# EAGLE design main (EAGLE 9.6.2)
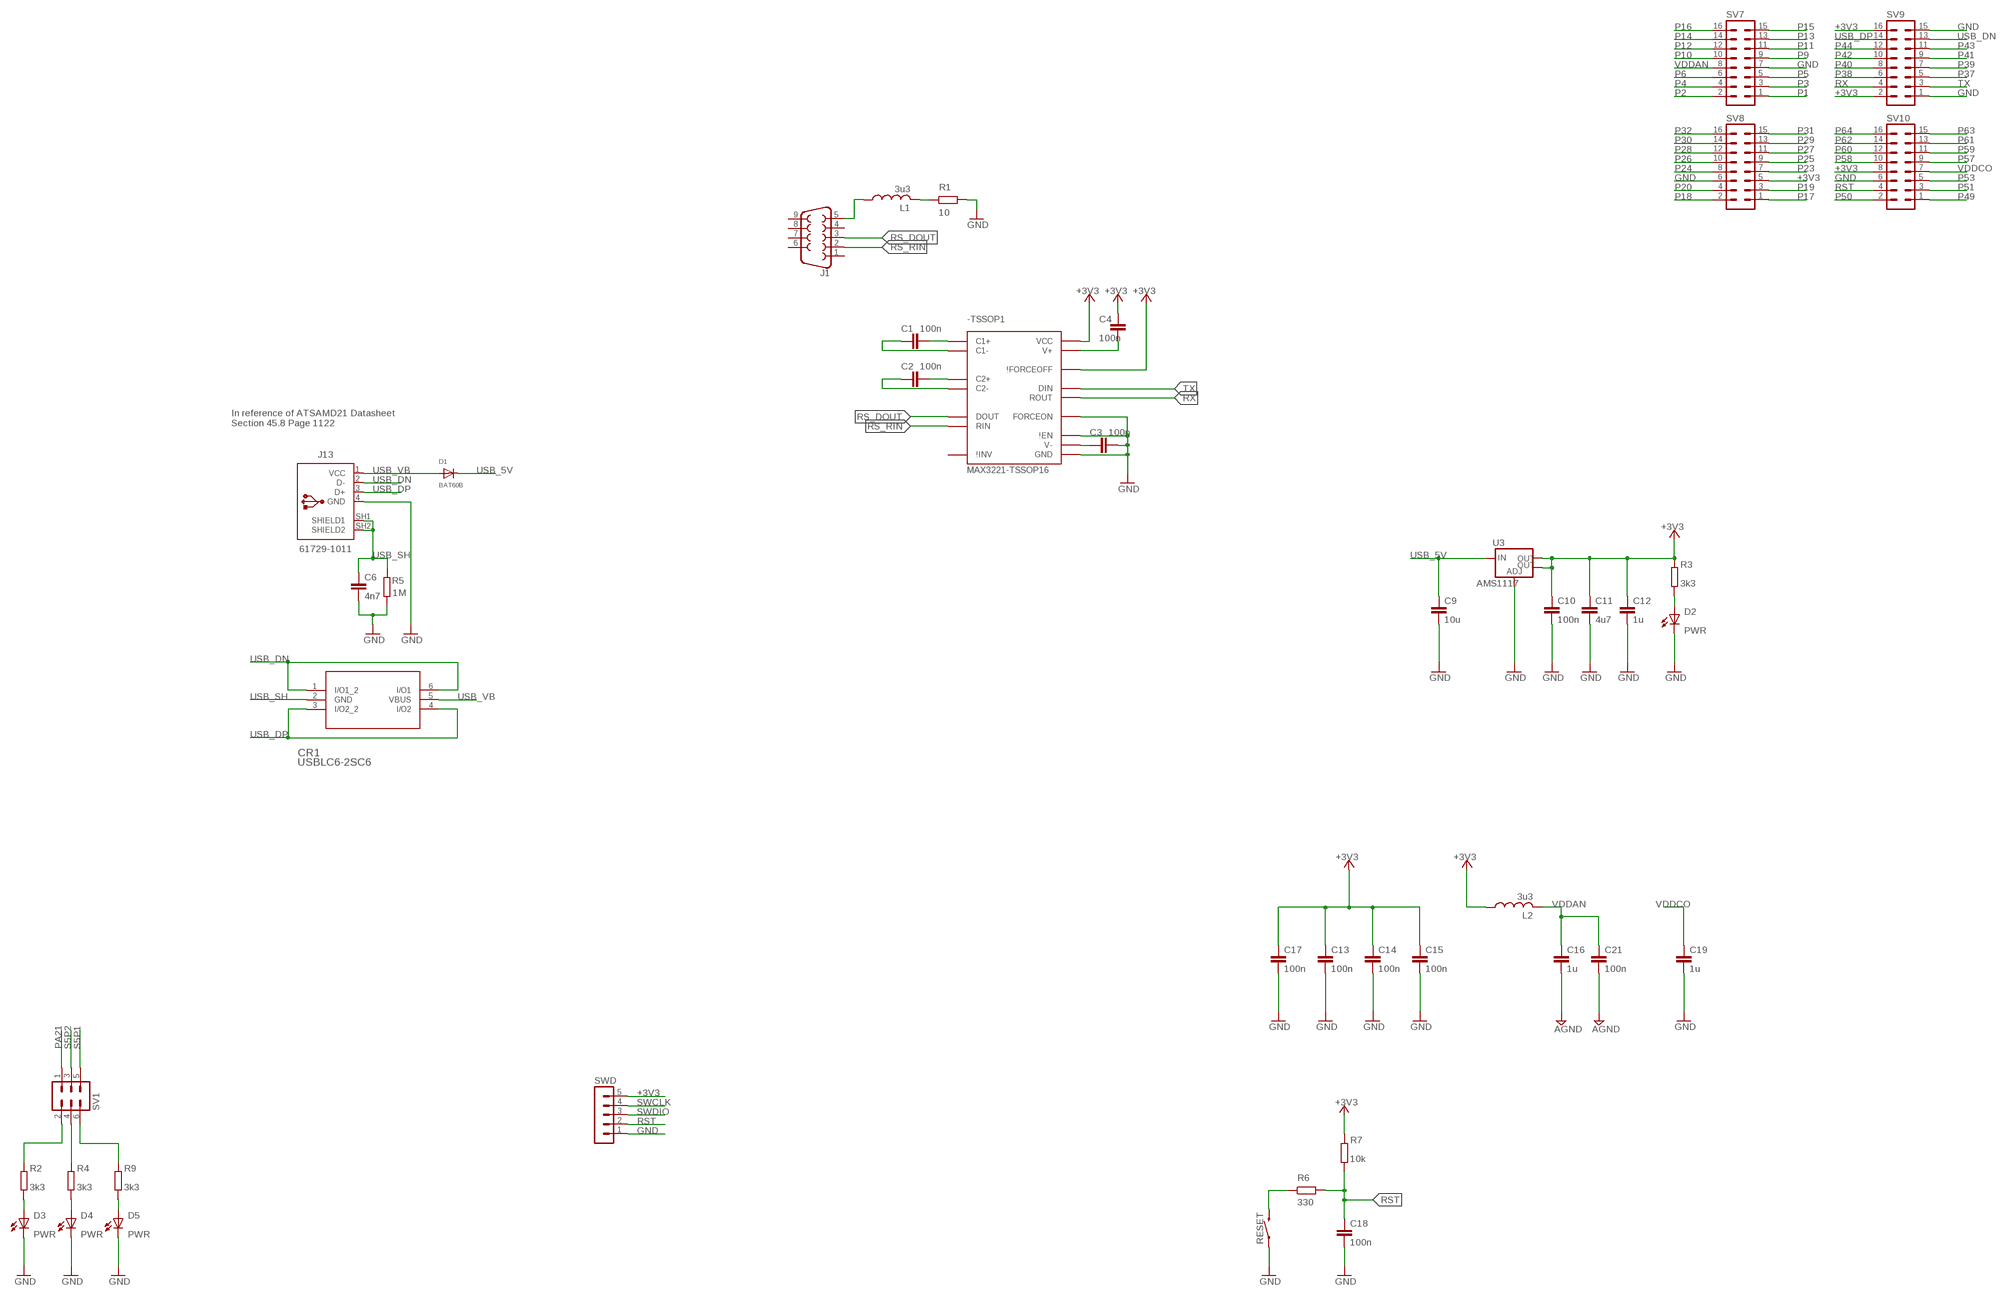
[diagram p0: schematic, sheet 1]

## Parts
-TSSOP1  MAX3221-TSSOP16  [TSSOP16]
C1  100n  C-EUC0603  [C0603]
C2  100n  C-EUC0603  [C0603]
C3  100n  C-EUC0603  [C0603]
C4  100n  C-EUC0603  [C0603]
C6  4n7  C-EUC0603  [C0603]
C9  10u  C-EUC0603  [C0603]
C10  100n  C-EUC0603  [C0603]
C11  4u7  C-EUC0603  [C0603]
C12  1u  C-EUC0603  [C0603]
C13  100n  C-EUC0603  [C0603]
C14  100n  C-EUC0603  [C0603]
C15  100n  C-EUC0603  [C0603]
C16  1u  C-EUC0603  [C0603]
C17  100n  C-EUC0603  [C0603]
C18  100n  C-EUC0603  [C0603]
C19  1u  C-EUC0603  [C0603]
C21  100n  C-EUC0603  [C0603]
CR1  USBLC6-2SC6  [SOT23-6L_STM]
D1  BAT60B  DIODESOD-323F  [SOD-323F]
D2  PWR  LEDCHIPLED_0805  [CHIPLED_0805]
D3  PWR  LEDCHIPLED_0805  [CHIPLED_0805]
D4  PWR  LEDCHIPLED_0805  [CHIPLED_0805]
D5  PWR  LEDCHIPLED_0805  [CHIPLED_0805]
J1  DB9FEMALE  [DB9]
J13  61729-1011  [61729-1011BLF]
L1  3u3  L-USL3216C  [L3216C]
L2  3u3  L-USL3216C  [L3216C]
R1  10  R-EU_R0603  [R0603]
R2  3k3  R-EU_R0603  [R0603]
R3  3k3  R-EU_R0603  [R0603]
R4  3k3  R-EU_R0603  [R0603]
R5  1M  R-EU_R0603  [R0603]
R6  330  R-EU_R0603  [R0603]
R7  10k  R-EU_R0603  [R0603]
R9  3k3  R-EU_R0603  [R0603]
RESET  MOMENTARY-SWITCH-SPST-SMD-6.0X3.5MM  [TACTILE_SWITCH_SMD_6.0X3.5MM]
SV1  MA03-2  [MA03-2]
SV7  MA08-2  [MA08-2]
SV8  MA08-2  [MA08-2]
SV9  MA08-2  [MA08-2]
SV10  MA08-2  [MA08-2]
SWD  MA05-1  [MA05-1]
U3  AMS1117  V_REG_LM1117SOT223  [SOT223]

## Nets
+3V3: -TSSOP1.15(VCC) -TSSOP1.16(\!FORCEOFF) C4.2 C10.1 C11.1 C12.1 C13.1 C14.1 C15.1 C17.1 L2.1 R3.2 R7.1 SV8.5 SV9.2 SV9.16 SV10.8 SWD.5 U3.2(OUT) U3.4(OUT)
GND: -TSSOP1.1(\!EN) -TSSOP1.12(FORCEON) -TSSOP1.14(GND) C3.2 C6.2 C9.2 C10.2 C11.2 C12.2 C13.2 C14.2 C15.2 C16.2 C17.2 C18.2 C19.2 C21.2 D2.C D3.C D4.C D5.C J13.4(GND) R1.2 R5.2 RESET.1 SV7.7 SV8.6 SV9.1 SV9.15 SV10.6 SWD.1 U3.1(ADJ) ; supply symbol labelled AGND
N$1: -TSSOP1.4(C1-) C1.1
N$2: R6.1 RESET.2
N$3: -TSSOP1.7(V-) C3.1
N$4: D2.A R3.1
N$9: D3.A R2.1
N$10: D4.A R4.1
N$11: -TSSOP1.6(C2-) C2.1
N$12: J1.5 L1.1
N$13: D5.A R9.1
N$14: R2.2 SV1.2
N$15: R4.2 SV1.4
N$16: R9.2 SV1.6
N$27: -TSSOP1.3(V+) C4.1
N$28: L1.2 R1.1
N$42: -TSSOP1.2(C1+) C1.2
N$43: -TSSOP1.5(C2+) C2.2
P1: SV7.1
P2: SV7.2
P3: SV7.3
P4: SV7.4
P5: SV7.5
P6: SV7.6
P9: SV7.9
P10: SV7.10
P11: SV7.11
P12: SV7.12
P13: SV7.13
P14: SV7.14
P15: SV7.15
P16: SV7.16
P17: SV8.1
P18: SV8.2
P19: SV8.3
P20: SV8.4
P23: SV8.7
P24: SV8.8
P25: SV8.9
P26: SV8.10
P27: SV8.11
P28: SV8.12
P29: SV8.13
P30: SV8.14
P31: SV8.15
P32: SV8.16
P37: SV9.5
P38: SV9.6
P39: SV9.7
P40: SV9.8
P41: SV9.9
P42: SV9.10
P43: SV9.11
P44: SV9.12
P49: SV10.1
P50: SV10.2
P51: SV10.3
P53: SV10.5
P57: SV10.9
P58: SV10.10
P59: SV10.11
P60: SV10.12
P61: SV10.13
P62: SV10.14
P63: SV10.15
P64: SV10.16
PA21: SV1.1
RS_DOUT: -TSSOP1.13(DOUT) J1.3
RS_RIN: -TSSOP1.8(RIN) J1.2
RST: C18.1 R6.2 R7.2 SV10.4 SWD.2
RX: -TSSOP1.9(ROUT) SV9.4
S5P1: SV1.5
S5P2: SV1.3
SWCLK: SWD.4
SWDIO: SWD.3
TX: -TSSOP1.11(DIN) SV9.3
USB_5V: C9.1 D1.C U3.3(IN)
USB_DN: CR1.1(I/O1_2) CR1.6(I/O1) J13.2(D-) SV9.13
USB_DP: CR1.3(I/O2_2) CR1.4(I/O2) J13.3(D+) SV9.14
USB_SH: C6.1 CR1.2(GND) J13.SH1(SHIELD1) J13.SH2(SHIELD2) R5.1
USB_VB: CR1.5(VBUS) D1.A J13.1(VCC)
VDDAN: C16.1 C21.1 L2.2 SV7.8
VDDCO: C19.1 SV10.7
Unconnected: -TSSOP1.10(\!INV) J1.1 J1.4 J1.6 J1.7 J1.8 J1.9

## Notes on the sheet
- In reference of ATSAMD21 Datasheet
  Section 45.8 Page 1122

## Library data of the parts
-TSSOP1 = MAX3221:MAX3221: Check availability <https://pricing.snapeda.com/parts/MAX3221/Texas%20Instruments/view-part?ref=eda>; AVAILABILITY: In Stock; DESCRIPTION: Single Transmitter/Receiver RS-232 16-Pin TSSOP Tube; MF: Texas Instruments; MP: MAX3221; PACKAGE: None; PRICE: None; PURCHASE-URL: https://pricing.snapeda.com/search/part/MAX3221/?ref=eda
C1-C4 C6 C9-C19 C21 = rcl:C-EU: CAPACITOR, European symbol; SPICEPREFIX: C
CR1 = usblc6:USBLC6-2SC6; COPYRIGHT: Copyright (C) 2023 Ultra Librarian. All rights reserved.; MANUFACTURER_PART_NUMBER: USBLC6-2SC6; MFR_NAME: STMicroelectronics
D1 = adafruit:DIODE: Diode SMADIODE - SMA Surface Mount Package 20V 1A Schottky Diode Digikey: 641-1014-6-ND DO-1N4148 - Through Hole Small Current Diode SOD-123 20V 1 A (.5mV Vf) Schottky Diode - Digikey: MBRX120TPMSCT-ND SOD-323 10V 570mA (.38mV Vf, 3ns) Schottky Diode - Digikey: ZLLS410CT-ND SOD-523 30V 30mA Schottky Diode (RB751S-40TE61) - Digikey: RB751S-40TE61CT-ND SOT23-R/W - SOT23 Package (R = Solder Paste/Reflow Ovens, W = Hand-Soldering) BAT54Film 40V 300mA - Digikey: 497-7162-1-ND
D2-D5 = adafruit:LED: LED OSRAM: - CHIPLED LG R971, LG N971, LY N971, LG Q971, LY Q971, LO R971, LY R971 LH N974, LH R974 LS Q976, LO Q976, LY Q976 LO Q996 - Hyper CHIPLED LW Q18S LB Q993, LB Q99A, LB R99A - SideLED LS A670, LO A670, LY A670, LG A670, LP A670 LB A673, LV A673, LT A673, LW A673 LH A674 LY A675 LS A676, LA A676, LO A676, LY A676, LW A676 LS A679, LY A679, LG A679 - Hyper Micro SIDELED® LS Y876, LA Y876, LO Y876, LY Y876 LT Y87S - SmartLED LW L88C, LW L88S LB L89C, LB L89S, LG L890 LS L89K, LO L89K, LY L89K LS L896, LA L896, LO L896, LY L896 - TOPLED LS T670, LO T670, LY T670, LG T670, LP T670 LSG T670, LSP T670, LSY T670, LOP T670, LYG T670 LG T671, LOG T671, LSG T671 LB T673, LV T673, LT T673, LW T673 LH T674 LS T676, LA T676, LO T676, LY T676, LB T676, LH T676, LSB T676, LW T676 LB T67C, LV T67C, LT T67C, LS T67K, LO T67K, LY T67K, LW E67C LS E67B, LA E67B, LO E67B, LY E67B, LB E67C, LV E67C, LT E67C LW T67C LS T679, LY T679, LG T679 LS T770, LO T770, LY T770, LG T770, LP T770 LB T773, LV T773, LT T773, LW T773 LH T774 LS E675, LA E675, LY E675, LS T675 LS T776, LA T776, LO T776, LY T776, LB T776 LHGB T686 LT T68C, LB T68C - Hyper Mini TOPLED® LB M676 - Mini TOPLED Santana® LG M470 LS M47K, LO M47K, LY M47K Source: http://www.osram.convergy.de/
J1 = SparkFun-Connectors:DB9: DB9 Connector Standard DB9 (D-Sub 9) serial connector. Can be used for CAN bus as well as RS485 and RS232. Footprint production proven. Here is the female version connector we sell at SparkFun: 9 Pin Female Serial Connector - PCB Mount <https://www.sparkfun.com/products/429> (PRT-00429) This connector has been used on the following SparkFun products: SparkFun RS232 Shifter - SMD <https://www.sparkfun.com/products/449> (PRT-00449) SparkFun RS232 Shifter SMD (No DB9) <https://www.sparkfun.com/products/8780> (PRT-08780); PROD_ID: CONN-08194
J13 = Connector_USB:61729-1011: USB(2.0) Type-B, RCPT, 4POS, THT-R/A Datasheet <https://www.amphenol-icc.com/media/wysiwyg/files/drawing/61729.pdf>; CATEGORY: Connector; CONTACTS: 4; CURRENT_RATING: 1A; DESCRIPTION: CONN RCPT USB2.0 TYPEB 4POS R/A; GENDER: Receptacle; MANUFACTURER: Amphenol ICC (FCI); MOUNT_TYPE: R/A; MPN: 61729-1011BLF; OPERATING_TEMP: -55°C to 85°C; PART_STATUS: Active; ROHS_COMPLIANT: RoHS Compliant; SERIES: 61729; SUB-CATEGORY: USB; TYPE: USB-B
L1 L2 = rcl:L-US: INDUCTOR, American symbol; SPICEPREFIX: L
R1-R7 R9 = rcl:R-EU_: RESISTOR, European symbol; SPICEPREFIX: R
RESET = SparkFun-Switches:MOMENTARY-SWITCH-SPST: Momentary Switch (Pushbutton) - SPST Normally-open (NO) SPST momentary switches (buttons, pushbuttons). Variants PTH-12MM - 12mm square, through-hole Momentary Pushbutton Switch - 12mm Square <https://www.sparkfun.com/products/9190> (COM-09190) PTH-6.0MM, PTH-6.0MM-KIT - 6.0mm square, through-hole Mini Pushbutton Switch <https://www.sparkfun.com/products/97> (COM-00097) KIT package intended for soldering kit's - only one side of pads' copper is exposed. PTH-RIGHT-ANGLE-KIT - Right-angle, through-hole Right Angle Tactile Button <https://www.sparkfun.com/products/10791> - Used on SparkFun BigTime Watch Kit <https://www.sparkfun.com/products/11734> SMD-12MM - 12mm square, surface-mount Tactile Button - SMD (12mm) <https://www.sparkfun.com/products/12993> (COM-12993) Used on SparkFun PicoBoard <https://www.sparkfun.com/products/11888> SMD-4.5MM - 4.5mm Square Trackball Switch Used on SparkFun Blackberry Trackballer Breakout <https://www.sparkfun.com/products/13169> SMD-4.6MMX2.8MM - 4.60mm x 2.80mm, surface mount Used on SparkFun Pro Micro - RP2040 <https://www.sparkfun.com/products/17717> SMD-5.2MM, SMD-5.2-REDUNDANT - 5.2mm square, surface-mount Mini Pushbutton Switch - SMD <https://www.sparkfun.com/products/8720> (COM-08720) Used on Arduino Pro Mini <https://www.sparkfun.com/products/11114> REDUNDANT package connects both switch circuits together SMD-6.0X3.5MM - 6.0 x 3.5mm, surface mount Momentary Reset Switch SMD <https://www.sparkfun.com/products/8229> (COM-08229) SMD-6.2MM-TALL - 6.2mm square, surface mount Tactile Button - SMD (6mm) <https://www.sparkfun.com/products/12992> Used on SparkFun Digital Sandbox <https://www.sparkfun.com/products/12651> SMD-RIGHT-ANGLE - Right-angle, surface mount Used on SparkFun Block for Intel® Edison - Arduino <https://www.sparkfun.com/products/13036>; PROD_ID: SWCH-14278; SF_SKU: COM-08229
SV1 = con-lstb:MA03-2: PIN HEADER; OC_FARNELL: unknown; OC_NEWARK: unknown
SV7-SV10 = con-lstb_custom2:MA08-2: PIN HEADER; OC_FARNELL: unknown; OC_NEWARK: unknown
SWD = con-lstb:MA05-1: PIN HEADER; OC_FARNELL: unknown; OC_NEWARK: unknown
U3 = SparkFun-IC-Power:V_REG_LM1117: Voltage Regulator LM1117 Standard adjustable voltage regulator but in SMD form. Spark Fun Electronics SKU : COM-00595; PROD_ID: VREG-08170

## Module HX711_CIRCUITRY
Ports: 

### Library data of the parts

## Board
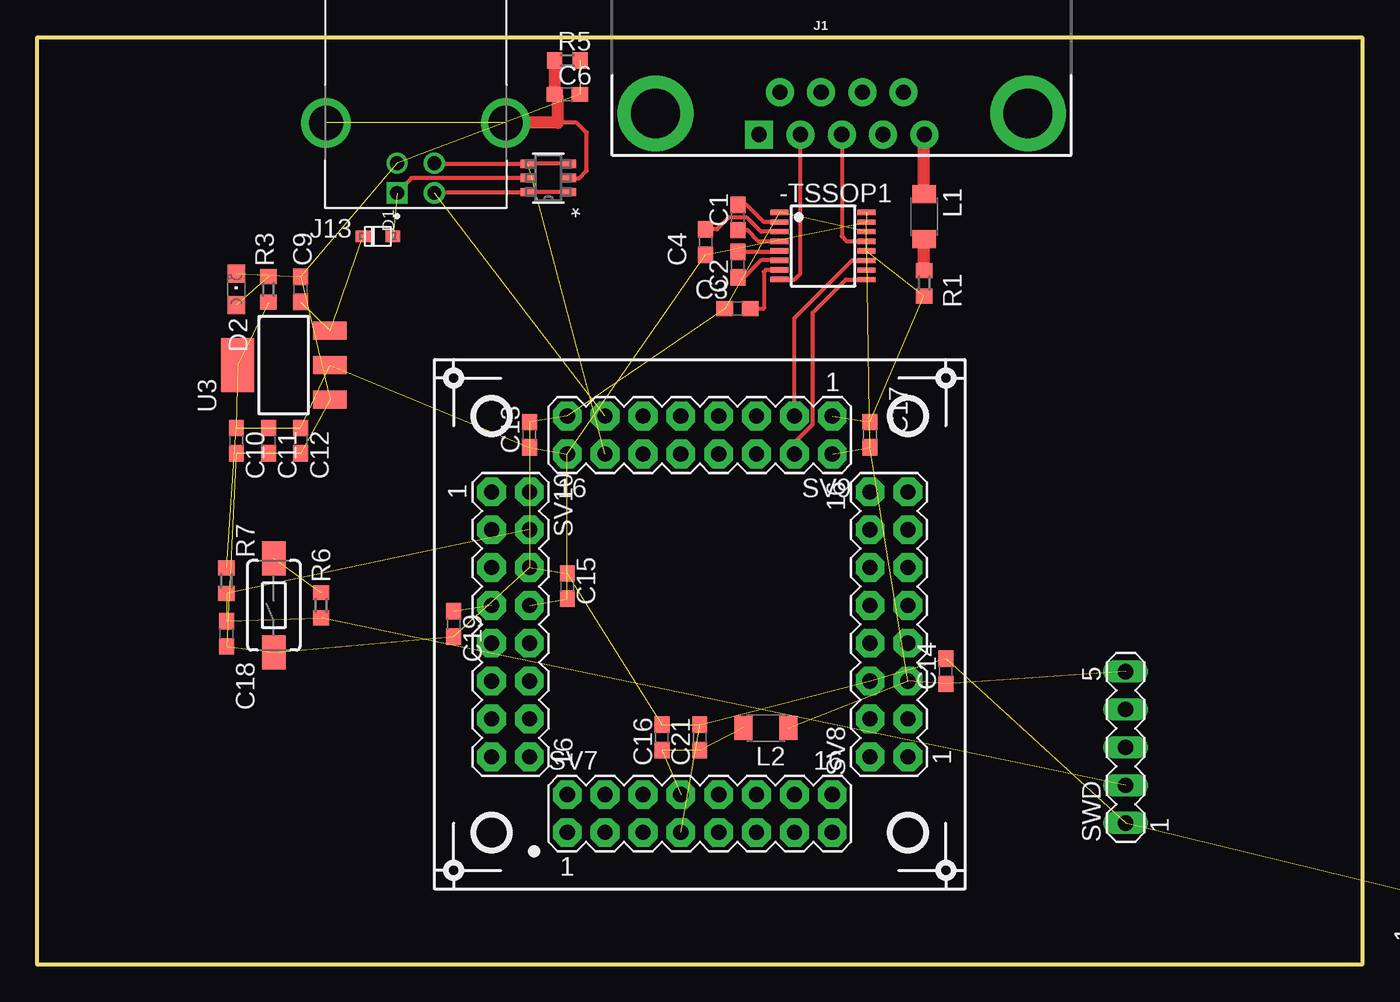
[diagram p1: board, top side]

Size 88.9 x 62.23 mm. Coordinates in mm from the lower left corner, seen from the top.
Outline: 0,0 0,62.23 88.9,62.23 88.9,0 0,0
Copper layers (1*16): Top 0.035mm / dielectric 1.5mm / Bottom 0.035mm
Design rules "default *": minimum track width 6mil, minimum drill 0.35mm, track to track 6mil, track to pad 6mil, pad to pad 6mil, via to via 6mil, smd to smd 6mil, copper to edge 0mil, drill to drill 6mil, minimum pad ring 10mil, minimum via ring 8mil, stop-mask expansion 4mil, vias tented up to drill 0mil, thermal gap 10mil

### Footprints (pad centres in the part's own frame; a part is rotated, then mirrored left to right if it is on the bottom)
TSSOP16 = smd 0.35 x 1.2: 1 -0.975,-2.925; 2 -0.325,-2.925; 3 0.325,-2.925; 4 0.975,-2.925; 5 1.605,-2.925; 6 2.245,-2.925; 7 2.885,-2.925; 8 3.525,-2.925; 9 3.535,2.925; 10 2.895,2.925; 11 2.255,2.925; 12 1.615,2.925; 13 0.975,2.925; 14 0.325,2.925; 15 -0.325,2.925; 16 -0.975,2.925
C0603 = smd 1.1 x 1: 1 -0.85,0; 2 0.85,0
SOT23-6L_STM = smd 0.978 x 0.559: 1 -1.365,0.95; 2 -1.365,0; 3 -1.365,-0.95; 4 1.365,-0.95; 5 1.365,0; 6 1.365,0.95
SOD-323F = smd 1 x 0.8: A -1,0; C 1,0
CHIPLED_0805 = smd 1.2 x 1.2: A 0,-1.05; C 0,1.05
DB9 = drill 1.016 pad 1.88 square: 1 -5.54,-1.42 | drill 1.016 pad 1.88: 2 -2.77,-1.42; 3 0,-1.42; 4 2.77,-1.42; 5 5.54,-1.42; 6 -4.15,1.42; 7 -1.38,1.42; 8 1.38,1.42; 9 4.15,1.42 | drill 3.302 pad 5.08: G1 -12.5,0; G2 12.5,0
61729-1011BLF = drill 0.92 square: 1 1.25,4.71 | drill 0.92: 2 -1.25,4.71; 3 -1.25,2.71; 4 1.25,2.71 | drill 2.3: SH1 -6.02,0; SH2 6.02,0
L3216C = smd 1.2 x 1.6: 1 -1.5,0; 2 1.5,0
R0603 = smd 1 x 1.1: 1 -0.85,0; 2 0.85,0
TACTILE_SWITCH_SMD_6.0X3.5MM = smd 2.3 x 1.6: 1 -3.15,0; 2 3.15,0
MA03-2 = drill 1.016: 1 -2.54,-1.27 | drill 1.016 octagon: 2 -2.54,1.27; 3 0,-1.27; 4 0,1.27; 5 2.54,-1.27; 6 2.54,1.27
MA08-2 = drill 1.016 pad 1.93 octagon: 1 -8.89,-1.27; 2 -8.89,1.27; 3 -6.35,-1.27; 4 -6.35,1.27; 5 -3.81,-1.27; 6 -3.81,1.27; 7 -1.27,-1.27; 8 -1.27,1.27; 9 1.27,-1.27; 10 1.27,1.27; 11 3.81,-1.27; 12 3.81,1.27; 13 6.35,-1.27; 14 6.35,1.27; 15 8.89,-1.27; 16 8.89,1.27
MA05-1 = drill 1.016 long: 1 -5.08,0; 2 -2.54,0; 3 0,0; 4 2.54,0; 5 5.08,0
SOT223 = smd 1.219 x 2.235: 1 -2.311,-3.099; 2 0,-3.099; 3 2.311,-3.099 | smd 3.6 x 2.2: 4 0,3.099

### Placement (x,y rotation side)
-TSSOP1  52.72,49.5 270 top
C1  47.01,50.14 90 top
C2  47.01,46.96 90 top
C3  46.99,44.03 180 top
C4  44.85,48.49 270 top
C6  35.56,58.39 0 top
C9  17.68,45.31 90 top
C10  13.36,35.15 270 top
C11  15.52,35.15 270 top
C12  17.68,35.15 270 top
C13  33.02,35.56 90 top
C14  60.96,19.68 90 top
C15  35.56,25.4 90 top
C16  41.91,15.24 90 top
C17  55.88,35.56 90 top
C18  12.7,22.2 270 top
C19  27.94,22.86 270 top
C21  44.45,15.24 90 top
CR1  34.29,52.78 180 top
D1  22.86,48.87 180 top
D2  13.36,45.31 0 top
D3  103.5,1.88 270 top  (outside the outline)
D4  103.5,-0.66 270 top  (outside the outline)
D5  103.5,-3.2 270 top  (outside the outline)
J1  53.98,57.12 0 top
J13  25.4,56.49 180 top
L1  59.5,50.19 270 top
L2  48.9,15.88 180 top
R1  59.5,45.72 270 top
R2  99.69,1.88 180 top  (outside the outline)
R3  15.52,45.31 270 top
R4  99.69,-0.66 180 top  (outside the outline)
R5  35.56,60.68 0 top
R6  19.05,24.1 270 top
R7  12.7,25.76 270 top
R9  99.69,-3.2 180 top  (outside the outline)
RESET  15.88,24.1 90 top
SV1  95.25,-0.66 270 top  (outside the outline)
SV7  44.45,10.13 0 top
SV8  57.15,22.83 90 top
SV9  44.45,35.53 180 top
SV10  31.75,22.83 270 top
SWD  73.03,14.58 90 top
U3  16.54,40.23 90 top

### Tracks (layer width: path | path; a pad name or v marks a point on that pad's centre or on a via)
+3V3  (19 unrouted)
GND  (31 unrouted)
N$1
  Top 0.254: -TSSOP1.4 48.4,48.53 47.64,49.29 C1.1
N$2  (1 unrouted)
N$3
  Top 0.254: -TSSOP1.7 48.88,46.62 48.74,46.48 48.74,44.03 C3.1
N$4  (1 unrouted)
N$9  (1 unrouted)
N$10  (1 unrouted)
N$11
  Top 0.254: -TSSOP1.6 48.56,47.26 47.41,46.11 C2.1
N$12
  Top 0.813: L1.1 59.5,55.69 J1.5
N$13  (1 unrouted)
N$14  (1 unrouted)
N$15  (1 unrouted)
N$16  (1 unrouted)
N$27
  Top 0.254: -TSSOP1.3 48.56,49.18 47.62,50.12 46.39,50.12 45.61,49.34 C4.1
N$28
  Top 0.813: R1.1 L1.2
N$42
  Top 0.254: -TSSOP1.2 48.75,49.83 47.59,50.99 C1.2
N$43
  Top 0.254: -TSSOP1.5 49.71,47.81 C2.2
RS_DOUT
  Top 0.254: -TSSOP1.13 54.32,48.53 53.98,48.87 J1.3
RS_RIN
  Top 0.254: -TSSOP1.8 50.81,45.98 51.21,46.38 J1.2
RST  (4 unrouted)
RX
  Top 0.254: SV9.4 50.8,35.04 52.05,36.29 52.05,43.76 54.25,45.97 -TSSOP1.9
TX
  Top 0.254: SV9.3 50.8,43.38 54.67,47.25 -TSSOP1.11
USB_5V  (2 unrouted)
  Top 0.813: U3.3 19.66,42.52
USB_DN  (1 unrouted)
  Top 0.254: J13.2 26.7,51.83 CR1.6 CR1.1
USB_DP  (1 unrouted)
  Top 0.254: J13.3 26.7,53.73 CR1.4 CR1.3
USB_SH  (1 unrouted)
  Top 0.254: CR1.2 36.37,52.78 36.86,53.26 36.86,55.83 36.2,56.49 34.93,56.49 | 31.75,56.49 J13.SH1
  Top 0.813: R5.1 C6.1 34.93,58.18 34.93,56.49 31.75,56.49
USB_VB  (1 unrouted)
  Top 0.254: J13.1 24.15,51.83 25.1,52.78 CR1.5
VDDAN  (3 unrouted)
VDDCO  (1 unrouted)

### Text on the board
tValues: GPIO | SWD | SERIAL1 | SERIAL2